# Altium schematic sheet Transceiver.SchDoc
size A4; SheetNumber: 7; SheetTotal: 7
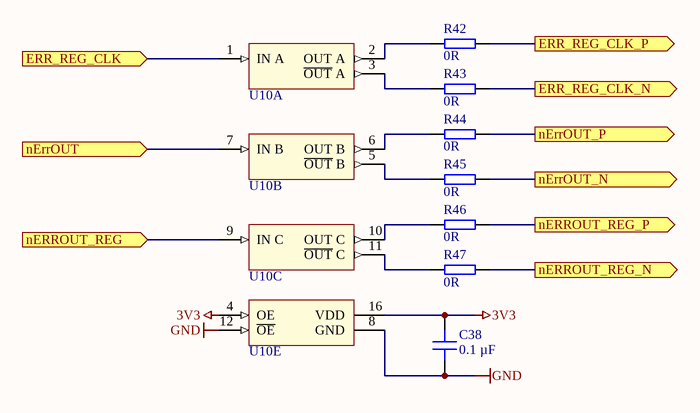
[diagram p0: Transceiver.SchDoc]

## Parts
C38  0.1 µF  [C_0603]
R42  0R  [RES 0603_1608]
R43  0R  [RES 0603_1608]
R44  0R  [RES 0603_1608]
R45  0R  [RES 0603_1608]
R46  0R  [RES 0603_1608]
R47  0R  [RES 0603_1608]
U10  DS26C31TMX/NOPB  [TI_D-R-PDSO-G16_N]  (value not drawn)  (parts A,B,C,E of 5)

## Ports
ERR_REG_CLK (in), ERR_REG_CLK_N (out), ERR_REG_CLK_P (out), nErrOUT (in), nErrOUT_N (out), nErrOUT_P (out), nERROUT_REG (in), nERROUT_REG_N (out), nERROUT_REG_P (out)

## Nets
3V3: C38.2 U10.4(OE) U10.16(VDD)
GND: C38.1 U10.8(GND) U10.12(~{OE})
ERR_REG_CLK: U10.1(IN_A) ; port ERR_REG_CLK
ERR_REG_CLK_N: R43.2 ; port ERR_REG_CLK_N
ERR_REG_CLK_P: R42.2 ; port ERR_REG_CLK_P
nErrOUT: U10.7(IN_B) ; port nErrOUT
nErrOUT_N: R45.2 ; port nErrOUT_N
nErrOUT_P: R44.2 ; port nErrOUT_P
nERROUT_REG: U10.9(IN_C) ; port nERROUT_REG
nERROUT_REG_N: R47.2 ; port nERROUT_REG_N
nERROUT_REG_P: R46.2 ; port nERROUT_REG_P
NetR42_1: R42.1 U10.2(OUT_A)
NetR43_1: R43.1 U10.3(~{OUT}_A)
NetR44_1: R44.1 U10.6(OUT_B)
NetR45_1: R45.1 U10.5(~{OUT}_B)
NetR46_1: R46.1 U10.10(OUT_C)
NetR47_1: R47.1 U10.11(~{OUT}_C)

## Library data of the parts
C38 = C0603X104K5RAC7411: Capacitor 0603, 50 VDC, 0.1 µF, X7R; Manufacturer: KEMET; Tolerance: 10 %; Voltage Rating: 50 VDC; Created from: MGremer; Manufacturer Part Number: C0603X104K5RAC7411; PartID: 3; Created On: 20.12.2020 13:54:13; ComponentLink1Description: Datasheet; ComponentLink1URL: https://www.mouser.de/datasheet/2/212/1/KEM_C1013_X7R_FT_CAP_SMD-1103280.pdf; Component Type: Capacitor 0603; Device Package: 0603; Last Updated: 04.03.2021 09:24:28; Mounting Type: SMD; Operating Temperature: -55 - 125°C; Series: SMD Comm X7R Flex; Supplier 1: Mouser; Supplier Part Number 1: 80-C0603X104K5R7411; Supplier 2: LCSC; Supplier Part Number 2: C14663; Type: Capacitor; Value: 0.1 µF; Live Cycle Status: 1; LCSC Part Number: C14663; Stock number: Labor SMD Container
R42-R47 = RC0603JR-070RL: SMD resistor E24 series; Manufacturer: YAGEO; Tolerance: 5%; Created from: MGremer; Manufacturer Part Number: RC0603JR-070RL; PartID: 1; Created On: 14.12.2020 16:17:14; ComponentLink1Description: Datasheet; ComponentLink1URL: https://www.mouser.de/datasheet/2/447/PYu-RC_Group_51_RoHS_L_10-1664068.pdf; Component Type: SMD resistor; Device Package: 0603; Last Updated: 04.03.2021 09:09:42; Mounting Type: SMD; Supplier 1: Mouser; Supplier Part Number 1: 603-RC0603JR-070RL; Supplier 2: LCSC; Supplier Part Number 2: C21189; Type: Resistor; Value: 0R; Live Cycle Status: 1; Stock number: Labor SMD Container; LCSC Part Number: C21189
U10 = DS26C31TMX/NOPB: CMOS Quad Tri-State Differential Line Drivers, 16-pin Narrow SOIC, Pb-Free; Manufacturer: Texas Instruments; Created from: T. Wendt; Manufacturer Part Number: DS26C31TMX/NOPB; PartID: 1; Created On: 01.03.2021 10:08:45; ComponentLink1Description: Datasheet; ComponentLink1URL: http://www.ti.com/general/docs/lit/getliterature.tsp?genericPartNumber=DS26C31T&fileType=pdf; Component Type: RS422 Driver; Device Package: SOIC; Last Updated: 04.03.2021 09:04:43; Minimum Order: 1; Mounting Type: SMD; Operating Temperature: -40°C - 85°C; Series: DS26C31; Supplier 1: Digi-Key; Supplier Part Number 1: DS26C31TMX/NOPBCT-ND; Supplier 2: Mouser; Supplier Part Number 2: 926-DS26C31TMX/NOPB; Supplier 3: LCSC; Supplier Part Number 3: C132085; Type: Standard; Live Cycle Status: 1; Stock number: not stored; LCSC Part Number: C132085